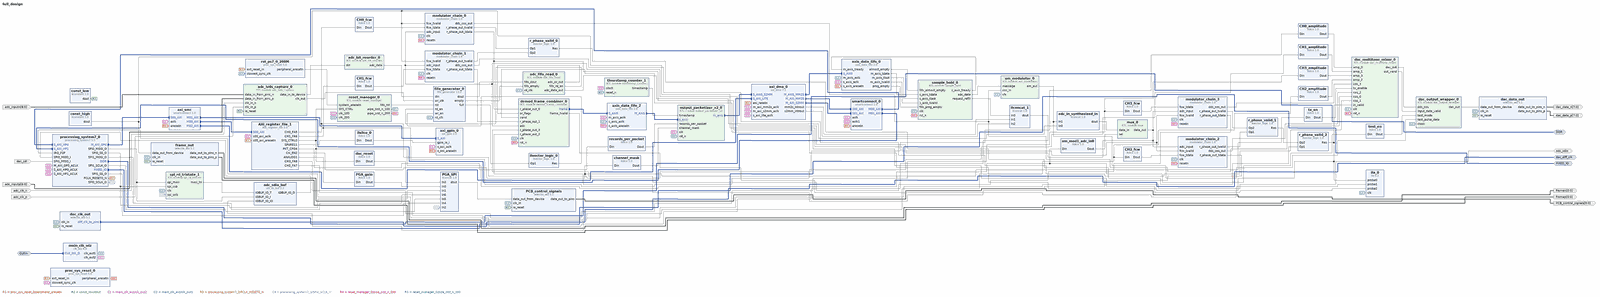
[diagram p0: block diagram of the top level, whole]
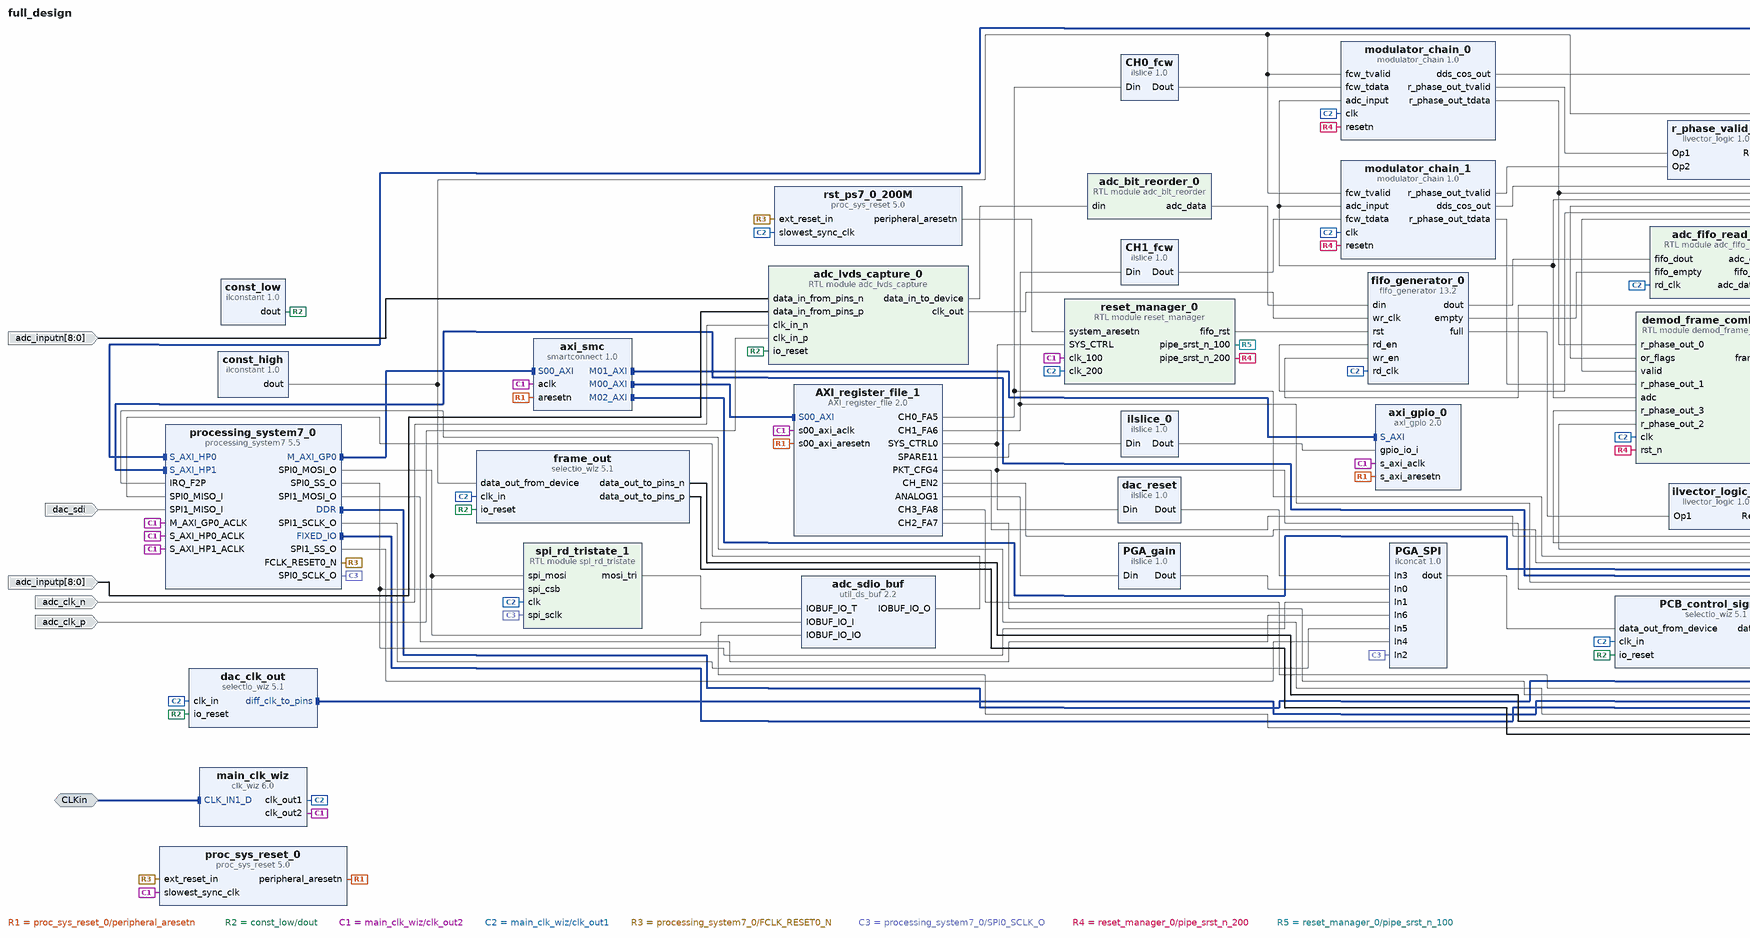
[diagram p1: block diagram of the top level, left part]
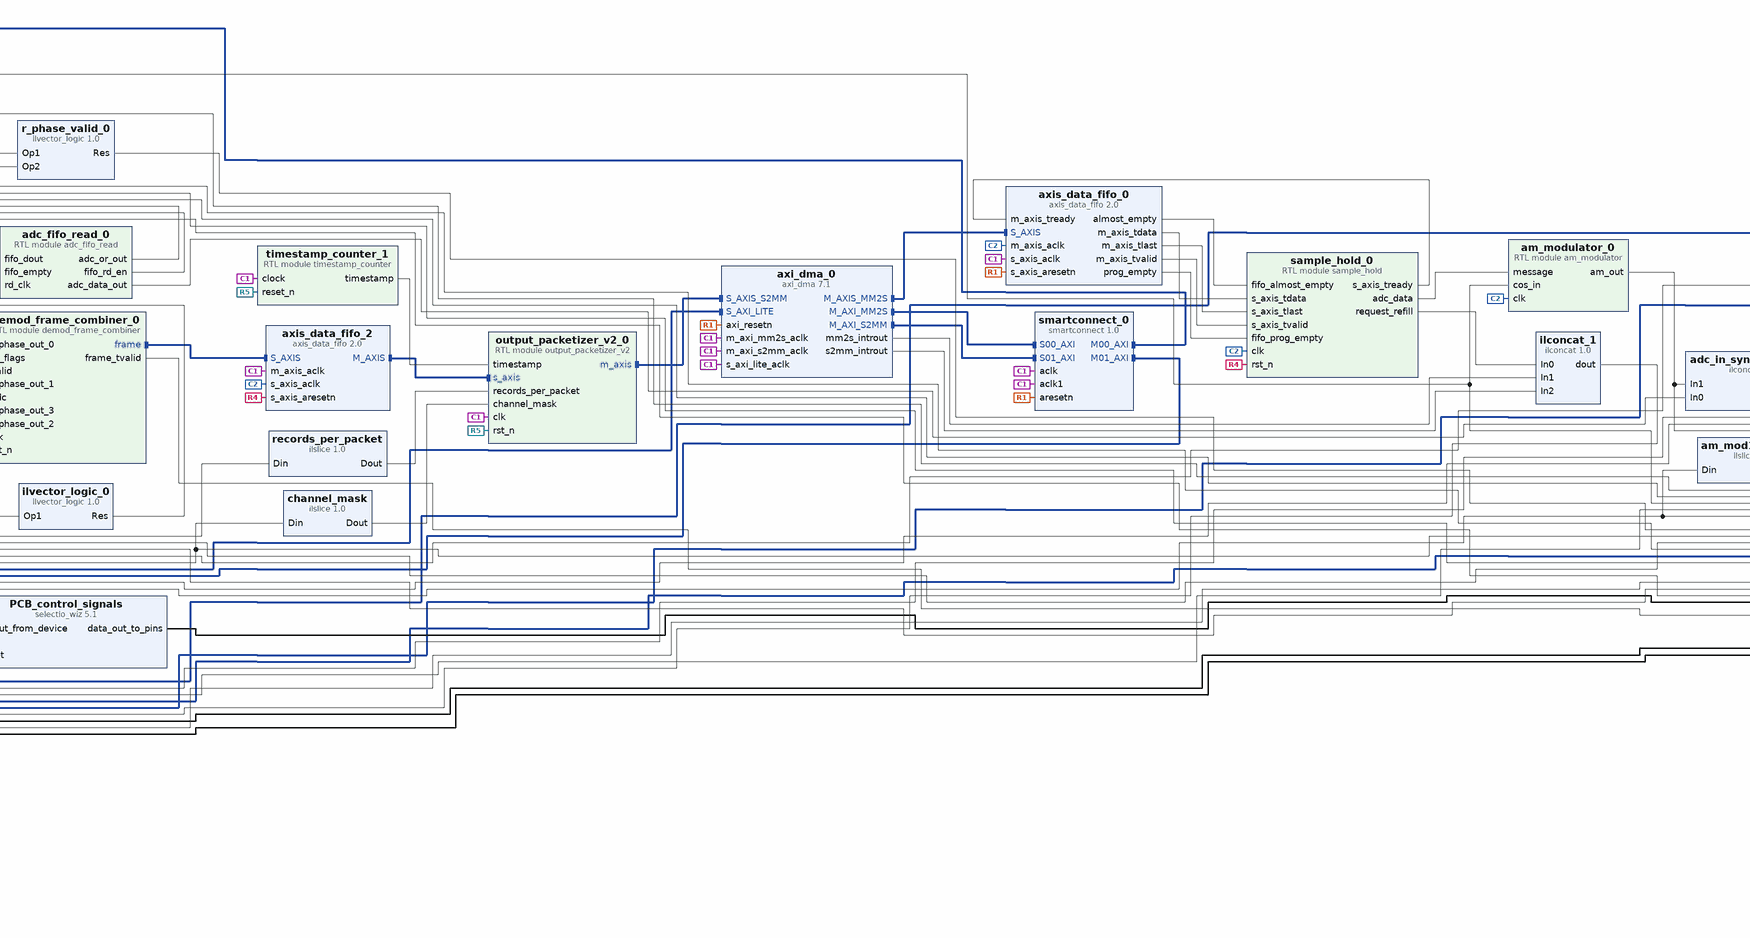
[diagram p2: block diagram of the top level, centre part]
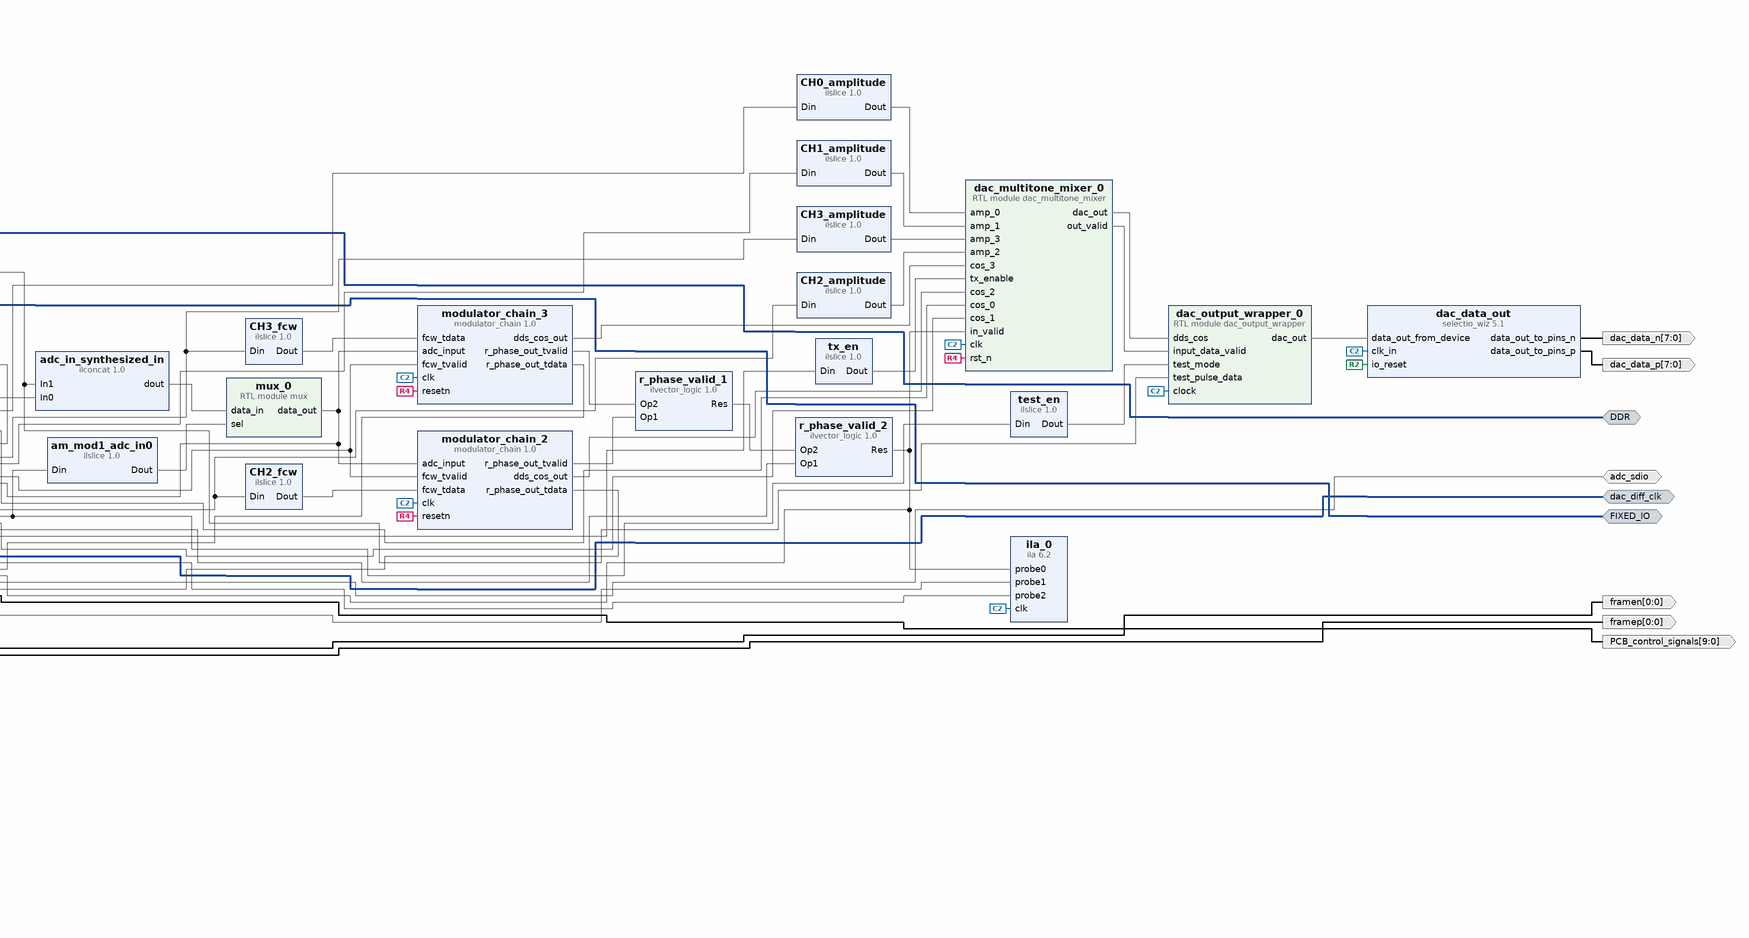
[diagram p3: block diagram of the top level, right part]
# Vivado block design full_design, xc7z020clg484-2, Vivado 2025.2
create_bd_design full_design

create_bd_intf_port -mode Master -vlnv xilinx.com:interface:ddrx_rtl:1.0 DDR
create_bd_intf_port -mode Master -vlnv xilinx.com:display_processing_system7:fixedio_rtl:1.0 FIXED_IO
create_bd_intf_port -mode Master -vlnv xilinx.com:interface:diff_clock_rtl:1.0 dac_diff_clk
create_bd_intf_port -mode Slave -vlnv xilinx.com:interface:diff_clock_rtl:1.0 CLKin
set_property -dict {CONFIG.FREQ_HZ 200000000} [get_bd_intf_ports CLKin]
create_bd_port -dir O -from 7 -to 0 dac_data_p
create_bd_port -dir O -from 7 -to 0 dac_data_n
create_bd_port -dir IO -type data adc_sdio
create_bd_port -dir O -from 9 -to 0 PCB_control_signals
create_bd_port -dir I -type data dac_sdi
create_bd_port -dir I -from 8 -to 0 -type data adc_inputp
create_bd_port -dir I -from 8 -to 0 -type data adc_inputn
create_bd_port -dir O -from 0 -to 0 framen
create_bd_port -dir O -from 0 -to 0 framep
create_bd_port -dir I adc_clk_p
create_bd_port -dir I adc_clk_n

create_bd_cell -type ip -vlnv xilinx.com:ip:processing_system7:5.5 processing_system7_0
set_property -dict [list \
  CONFIG.PCW_ENET0_ENET0_IO {MIO 16 .. 27} \
  CONFIG.PCW_ENET0_GRP_MDIO_ENABLE 1 \
  CONFIG.PCW_ENET0_GRP_MDIO_IO {MIO 52 .. 53} \
  CONFIG.PCW_ENET0_PERIPHERAL_ENABLE 1 \
  CONFIG.PCW_ENET_RESET_ENABLE 0 \
  CONFIG.PCW_EN_CLK0_PORT 0 \
  CONFIG.PCW_FPGA0_PERIPHERAL_FREQMHZ 200 \
  CONFIG.PCW_GPIO_MIO_GPIO_ENABLE 1 \
  CONFIG.PCW_GPIO_MIO_GPIO_IO MIO \
  CONFIG.PCW_I2C0_GRP_INT_ENABLE 0 \
  CONFIG.PCW_I2C0_I2C0_IO {MIO 10 .. 11} \
  CONFIG.PCW_I2C0_PERIPHERAL_ENABLE 1 \
  CONFIG.PCW_I2C1_I2C1_IO EMIO \
  CONFIG.PCW_I2C1_PERIPHERAL_ENABLE 1 \
  CONFIG.PCW_I2C_PERIPHERAL_FREQMHZ 111.111115 \
  CONFIG.PCW_I2C_RESET_ENABLE 0 \
  CONFIG.PCW_IRQ_F2P_INTR 1 \
  CONFIG.PCW_PRESET_BANK1_VOLTAGE {LVCMOS 1.8V} \
  CONFIG.PCW_QSPI_GRP_FBCLK_ENABLE 1 \
  CONFIG.PCW_QSPI_GRP_FBCLK_IO {MIO 8} \
  CONFIG.PCW_QSPI_GRP_SINGLE_SS_ENABLE 1 \
  CONFIG.PCW_QSPI_GRP_SINGLE_SS_IO {MIO 1 .. 6} \
  CONFIG.PCW_QSPI_PERIPHERAL_ENABLE 1 \
  CONFIG.PCW_QSPI_QSPI_IO {MIO 1 .. 6} \
  CONFIG.PCW_SD0_GRP_CD_ENABLE 0 \
  CONFIG.PCW_SD0_GRP_WP_ENABLE 0 \
  CONFIG.PCW_SD0_PERIPHERAL_ENABLE 1 \
  CONFIG.PCW_SD0_SD0_IO {MIO 40 .. 45} \
  CONFIG.PCW_SD1_PERIPHERAL_ENABLE 1 \
  CONFIG.PCW_SD1_SD1_IO {MIO 46 .. 51} \
  CONFIG.PCW_SDIO_PERIPHERAL_FREQMHZ 100 \
  CONFIG.PCW_SINGLE_QSPI_DATA_MODE x4 \
  CONFIG.PCW_SPI0_PERIPHERAL_ENABLE 1 \
  CONFIG.PCW_SPI0_SPI0_IO EMIO \
  CONFIG.PCW_SPI1_PERIPHERAL_ENABLE 1 \
  CONFIG.PCW_SPI1_SPI1_IO EMIO \
  CONFIG.PCW_TTC0_PERIPHERAL_ENABLE 1 \
  CONFIG.PCW_TTC0_TTC0_IO EMIO \
  CONFIG.PCW_TTC1_PERIPHERAL_ENABLE 1 \
  CONFIG.PCW_TTC1_TTC1_IO EMIO \
  CONFIG.PCW_UART0_PERIPHERAL_ENABLE 1 \
  CONFIG.PCW_UART0_UART0_IO {MIO 14 .. 15} \
  CONFIG.PCW_UART1_PERIPHERAL_ENABLE 1 \
  CONFIG.PCW_UART1_UART1_IO {MIO 12 .. 13} \
  CONFIG.PCW_UART_PERIPHERAL_FREQMHZ 100 \
  CONFIG.PCW_UIPARAM_DDR_PARTNO {MT41J256M16 RE-125} \
  CONFIG.PCW_USB0_PERIPHERAL_ENABLE 1 \
  CONFIG.PCW_USB0_USB0_IO {MIO 28 .. 39} \
  CONFIG.PCW_USB_RESET_ENABLE 0 \
  CONFIG.PCW_USE_FABRIC_INTERRUPT 1 \
  CONFIG.PCW_USE_S_AXI_HP0 1 \
  CONFIG.PCW_USE_S_AXI_HP1 1 \
  CONFIG.PCW_WDT_PERIPHERAL_ENABLE 1 \
  CONFIG.PCW_WDT_WDT_IO EMIO \
] [get_bd_cells processing_system7_0]
# 230 more settings of processing_system7_0 are not shown: defaults, MIO pin electricals, DDR timing, and values the tool derives
create_bd_cell -type ip -vlnv xilinx.com:ip:selectio_wiz:5.1 dac_data_out
set_property -dict [list \
  CONFIG.BUS_DIR OUTPUTS \
  CONFIG.BUS_IO_STD LVDS_25 \
  CONFIG.BUS_SIG_TYPE DIFF \
  CONFIG.CLK_FWD false \
  CONFIG.CLK_FWD_IO_STD DIFF_HSTL_I \
  CONFIG.CLK_FWD_SIG_TYPE DIFF \
  CONFIG.SELIO_ACTIVE_EDGE DDR \
  CONFIG.SELIO_BUS_IN_DELAY NONE \
  CONFIG.SELIO_CLK_BUF MMCM \
  CONFIG.SELIO_CLK_IO_STD LVDS_25 \
  CONFIG.SELIO_CLK_SIG_TYPE DIFF \
  CONFIG.SELIO_INTERFACE_TYPE NETWORKING \
  CONFIG.SELIO_ODDR_ALIGNMENT OPPOSITE_EDGE \
  CONFIG.SERIALIZATION_FACTOR 4 \
  CONFIG.SYSTEM_DATA_WIDTH 8 \
] [get_bd_cells dac_data_out]
create_bd_cell -type ip -vlnv xilinx.com:ip:smartconnect:1.0 axi_smc
set_property -dict {CONFIG.NUM_MI 3 CONFIG.NUM_SI 1} [get_bd_cells axi_smc]
create_bd_cell -type ip -vlnv xilinx.com:ip:proc_sys_reset:5.0 rst_ps7_0_200M
create_bd_cell -type ip -vlnv xilinx.com:ip:axi_gpio:2.0 axi_gpio_0
set_property -dict {CONFIG.C_ALL_INPUTS 1 CONFIG.C_GPIO_WIDTH 16 CONFIG.C_IS_DUAL 0} [get_bd_cells axi_gpio_0]
create_bd_cell -type inline_hdl -vlnv xilinx.com:inline_hdl:ilslice:1.0 test_en
set_property -dict {CONFIG.DIN_TO 8} [get_bd_cells test_en]
create_bd_cell -type ip -vlnv xilinx.com:ip:axi_dma:7.1 axi_dma_0
set_property -dict [list \
  CONFIG.c_include_mm2s_dre 0 \
  CONFIG.c_include_s2mm_dre 0 \
  CONFIG.c_include_sg 0 \
  CONFIG.c_m_axis_mm2s_tdata_width 16 \
  CONFIG.c_micro_dma 0 \
  CONFIG.c_sg_length_width 16 \
] [get_bd_cells axi_dma_0]
create_bd_cell -type ip -vlnv xilinx.com:ip:axis_data_fifo:2.0 axis_data_fifo_0
set_property -dict [list \
  CONFIG.FIFO_DEPTH 256 \
  CONFIG.HAS_AEMPTY 1 \
  CONFIG.HAS_PROG_EMPTY 1 \
  CONFIG.HAS_RD_DATA_COUNT 1 \
  CONFIG.HAS_TLAST 1 \
  CONFIG.IS_ACLK_ASYNC 1 \
  CONFIG.PROG_EMPTY_THRESH 251 \
  CONFIG.TDATA_NUM_BYTES 2 \
] [get_bd_cells axis_data_fifo_0]
create_bd_cell -type inline_hdl -vlnv xilinx.com:inline_hdl:ilconcat:1.0 ilconcat_1
set_property -dict {CONFIG.NUM_PORTS 3} [get_bd_cells ilconcat_1]
create_bd_cell -type ip -vlnv xilinx.com:ip:smartconnect:1.0 smartconnect_0
set_property -dict {CONFIG.NUM_CLKS 2 CONFIG.NUM_MI 2} [get_bd_cells smartconnect_0]
create_bd_cell -type module -reference sample_hold sample_hold_0
create_bd_cell -type ip -vlnv xilinx.com:ip:selectio_wiz:5.1 PCB_control_signals
set_property -dict [list \
  CONFIG.BUS_DIR OUTPUTS \
  CONFIG.BUS_IO_STD LVCMOS25 \
  CONFIG.CLK_FWD_IO_STD LVCMOS25 \
  CONFIG.SELIO_BUS_IN_DELAY NONE \
  CONFIG.SELIO_CLK_BUF MMCM \
  CONFIG.SELIO_CLK_IO_STD LVCMOS25 \
  CONFIG.SELIO_INTERFACE_TYPE NETWORKING \
  CONFIG.SERIALIZATION_FACTOR 4 \
  CONFIG.SYSTEM_DATA_WIDTH 10 \
] [get_bd_cells PCB_control_signals]
create_bd_cell -type inline_hdl -vlnv xilinx.com:inline_hdl:ilconcat:1.0 PGA_SPI
set_property -dict {CONFIG.IN0_WIDTH 4 CONFIG.NUM_PORTS 7} [get_bd_cells PGA_SPI]
create_bd_cell -type ip -vlnv xilinx.com:ip:util_ds_buf:2.2 adc_sdio_buf
set_property -dict {CONFIG.C_BUF_TYPE IOBUF} [get_bd_cells adc_sdio_buf]
create_bd_cell -type inline_hdl -vlnv xilinx.com:inline_hdl:ilslice:1.0 PGA_gain
set_property -dict {CONFIG.DIN_FROM 3} [get_bd_cells PGA_gain]
create_bd_cell -type module -reference mux mux_0
set_property -dict {CONFIG.N 2 CONFIG.SEL_BITS 1} [get_bd_cells mux_0]
create_bd_cell -type inline_hdl -vlnv xilinx.com:inline_hdl:ilconcat:1.0 adc_in_synthesized_in
set_property -dict {CONFIG.IN0_WIDTH 16 CONFIG.IN1_WIDTH 16} [get_bd_cells adc_in_synthesized_in]
create_bd_cell -type inline_hdl -vlnv xilinx.com:inline_hdl:ilslice:1.0 am_mod1_adc_in0
set_property -dict {CONFIG.DIN_TO 6} [get_bd_cells am_mod1_adc_in0]
create_bd_cell -type ip -vlnv xilinx.com:ip:clk_wiz:6.0 main_clk_wiz
set_property -dict [list \
  CONFIG.CLKIN1_JITTER_PS 5.0 \
  CONFIG.CLKIN1_UI_JITTER 0.001 \
  CONFIG.CLKIN2_JITTER_PS 1000000.0 \
  CONFIG.CLKIN2_UI_JITTER 0.010 \
  CONFIG.CLKOUT1_JITTER 86.436 \
  CONFIG.CLKOUT1_PHASE_ERROR 76.281 \
  CONFIG.CLKOUT1_REQUESTED_OUT_FREQ 200.000 \
  CONFIG.CLKOUT2_JITTER 98.807 \
  CONFIG.CLKOUT2_PHASE_ERROR 76.281 \
  CONFIG.CLKOUT2_REQUESTED_OUT_FREQ 100.000 \
  CONFIG.CLKOUT2_REQUESTED_PHASE 0 \
  CONFIG.CLKOUT2_USED true \
  CONFIG.JITTER_OPTIONS UI \
  CONFIG.JITTER_SEL Min_O_Jitter \
  CONFIG.MMCM_BANDWIDTH HIGH \
  CONFIG.MMCM_CLKFBOUT_MULT_F 7.000 \
  CONFIG.MMCM_CLKIN1_PERIOD 5.000 \
  CONFIG.MMCM_CLKIN2_PERIOD 10.000 \
  CONFIG.MMCM_CLKOUT0_DIVIDE_F 7.000 \
  CONFIG.MMCM_CLKOUT1_DIVIDE 14 \
  CONFIG.MMCM_CLKOUT1_PHASE 0.000 \
  CONFIG.MMCM_REF_JITTER1 0.001 \
  CONFIG.MMCM_REF_JITTER2 0.010 \
  CONFIG.NUM_OUT_CLKS 2 \
  CONFIG.PRIM_IN_FREQ 200.000 \
  CONFIG.PRIM_SOURCE Differential_clock_capable_pin \
  CONFIG.SECONDARY_SOURCE Single_ended_clock_capable_pin \
  CONFIG.USE_INCLK_SWITCHOVER false \
  CONFIG.USE_LOCKED false \
  CONFIG.USE_RESET false \
] [get_bd_cells main_clk_wiz]
create_bd_cell -type inline_hdl -vlnv xilinx.com:inline_hdl:ilconstant:1.0 const_high
set_property -dict {CONFIG.CONST_VAL 1 CONFIG.CONST_WIDTH 1} [get_bd_cells const_high]
create_bd_cell -type ip -vlnv xilinx.com:ip:fifo_generator:13.2 fifo_generator_0
set_property -dict [list \
  CONFIG.Fifo_Implementation Independent_Clocks_Block_RAM \
  CONFIG.Full_Flags_Reset_Value 0 \
  CONFIG.Input_Depth 32 \
  CONFIG.Performance_Options First_Word_Fall_Through \
] [get_bd_cells fifo_generator_0]
create_bd_cell -type inline_hdl -vlnv xilinx.com:inline_hdl:ilvector_logic:1.0 ilvector_logic_0
set_property -dict {CONFIG.C_OPERATION not CONFIG.C_SIZE 1} [get_bd_cells ilvector_logic_0]
create_bd_cell -type ip -vlnv xilinx.com:ip:selectio_wiz:5.1 frame_out
set_property -dict [list \
  CONFIG.BUS_DIR OUTPUTS \
  CONFIG.BUS_IO_STD LVDS_25 \
  CONFIG.BUS_SIG_TYPE DIFF \
  CONFIG.CLK_FWD_IO_STD LVDS_25 \
  CONFIG.CLK_FWD_SIG_TYPE DIFF \
  CONFIG.SELIO_BUS_IN_DELAY NONE \
  CONFIG.SELIO_CLK_BUF MMCM \
  CONFIG.SELIO_CLK_IO_STD LVDS_25 \
  CONFIG.SELIO_CLK_SIG_TYPE DIFF \
  CONFIG.SELIO_INTERFACE_TYPE NETWORKING \
  CONFIG.SERIALIZATION_FACTOR 4 \
  CONFIG.SYSTEM_DATA_WIDTH 1 \
] [get_bd_cells frame_out]
create_bd_cell -type ip -vlnv xilinx.com:ip:selectio_wiz:5.1 dac_clk_out
set_property -dict [list \
  CONFIG.BUS_DIR OUTPUTS \
  CONFIG.BUS_IO_STD LVDS_25 \
  CONFIG.BUS_SIG_TYPE DIFF \
  CONFIG.CLK_FWD true \
  CONFIG.CLK_FWD_IO_STD LVDS_25 \
  CONFIG.CLK_FWD_SIG_TYPE DIFF \
  CONFIG.CONFIG_CLK_FWD true \
  CONFIG.SELIO_BUS_IN_DELAY NONE \
  CONFIG.SELIO_CLK_BUF MMCM \
  CONFIG.SELIO_CLK_IO_STD LVDS_25 \
  CONFIG.SELIO_CLK_SIG_TYPE DIFF \
  CONFIG.SELIO_INTERFACE_TYPE NETWORKING \
  CONFIG.SERIALIZATION_FACTOR 4 \
  CONFIG.SYSTEM_DATA_WIDTH 1 \
] [get_bd_cells dac_clk_out]
create_bd_cell -type module -reference adc_lvds_capture adc_lvds_capture_0
create_bd_cell -type module -reference adc_fifo_read adc_fifo_read_0
create_bd_cell -type module -reference adc_bit_reorder adc_bit_reorder_0
create_bd_cell -type module -reference spi_rd_tristate spi_rd_tristate_1
create_bd_cell -type inline_hdl -vlnv xilinx.com:inline_hdl:ilconstant:1.0 const_low
set_property -dict {CONFIG.CONST_VAL 0 CONFIG.CONST_WIDTH 1} [get_bd_cells const_low]
create_bd_cell -type module -reference timestamp_counter timestamp_counter_1
create_bd_cell -type ip -vlnv xilinx.com:ip:proc_sys_reset:5.0 proc_sys_reset_0
set_property -dict {CONFIG.C_NUM_INTERCONNECT_ARESETN 1 CONFIG.C_NUM_PERP_ARESETN 1} [get_bd_cells proc_sys_reset_0]
create_bd_cell -type ip -vlnv alexclunan.com:user:AXI_register_file:2.0 AXI_register_file_1
create_bd_cell -type module -reference reset_manager reset_manager_0
create_bd_cell -type inline_hdl -vlnv xilinx.com:inline_hdl:ilslice:1.0 CH0_fcw
set_property -dict {CONFIG.DIN_FROM 15} [get_bd_cells CH0_fcw]
create_bd_cell -type inline_hdl -vlnv xilinx.com:inline_hdl:ilslice:1.0 CH0_amplitude
set_property -dict {CONFIG.DIN_FROM 31 CONFIG.DIN_TO 16} [get_bd_cells CH0_amplitude]
create_bd_cell -type module -reference dac_output_wrapper dac_output_wrapper_0
create_bd_cell -type inline_hdl -vlnv xilinx.com:inline_hdl:ilslice:1.0 CH1_fcw
set_property -dict {CONFIG.DIN_FROM 15} [get_bd_cells CH1_fcw]
create_bd_cell -type inline_hdl -vlnv xilinx.com:inline_hdl:ilslice:1.0 CH1_amplitude
set_property -dict {CONFIG.DIN_FROM 31 CONFIG.DIN_TO 16} [get_bd_cells CH1_amplitude]
create_bd_cell -type module -reference output_packetizer_v2 output_packetizer_v2_0
create_bd_cell -type ip -vlnv xilinx.com:ip:axis_data_fifo:2.0 axis_data_fifo_2
set_property -dict {CONFIG.FIFO_DEPTH 128 CONFIG.IS_ACLK_ASYNC 1 CONFIG.TDATA_NUM_BYTES 36} [get_bd_cells axis_data_fifo_2]
create_bd_cell -type inline_hdl -vlnv xilinx.com:inline_hdl:ilslice:1.0 CH2_amplitude
set_property -dict {CONFIG.DIN_FROM 31 CONFIG.DIN_TO 16} [get_bd_cells CH2_amplitude]
create_bd_cell -type inline_hdl -vlnv xilinx.com:inline_hdl:ilslice:1.0 CH2_fcw
set_property -dict {CONFIG.DIN_FROM 15} [get_bd_cells CH2_fcw]
create_bd_cell -type inline_hdl -vlnv xilinx.com:inline_hdl:ilslice:1.0 CH3_amplitude
set_property -dict {CONFIG.DIN_FROM 31 CONFIG.DIN_TO 16} [get_bd_cells CH3_amplitude]
create_bd_cell -type inline_hdl -vlnv xilinx.com:inline_hdl:ilslice:1.0 CH3_fcw
set_property -dict {CONFIG.DIN_FROM 15} [get_bd_cells CH3_fcw]
create_bd_cell -type inline_hdl -vlnv xilinx.com:inline_hdl:ilslice:1.0 records_per_packet
set_property -dict {CONFIG.DIN_FROM 7} [get_bd_cells records_per_packet]
create_bd_cell -type inline_hdl -vlnv xilinx.com:inline_hdl:ilslice:1.0 channel_mask
set_property -dict {CONFIG.DIN_FROM 8 CONFIG.DIN_TO 4} [get_bd_cells channel_mask]
create_bd_cell -type module -reference dac_multitone_mixer dac_multitone_mixer_0
create_bd_cell -type inline_hdl -vlnv xilinx.com:inline_hdl:ilslice:1.0 tx_en
set_property -dict {CONFIG.DIN_FROM 3} [get_bd_cells tx_en]
create_bd_cell -type inline_hdl -vlnv xilinx.com:inline_hdl:ilslice:1.0 ilslice_0
set_property -dict {CONFIG.DIN_FROM 15} [get_bd_cells ilslice_0]
create_bd_cell -type ip -vlnv alexclunan.com:user:modulator_chain:1.0 modulator_chain_0
create_bd_cell -type ip -vlnv alexclunan.com:user:modulator_chain:1.0 modulator_chain_1
create_bd_cell -type ip -vlnv alexclunan.com:user:modulator_chain:1.0 modulator_chain_3
create_bd_cell -type ip -vlnv alexclunan.com:user:modulator_chain:1.0 modulator_chain_2
create_bd_cell -type inline_hdl -vlnv xilinx.com:inline_hdl:ilslice:1.0 dac_reset
set_property -dict {CONFIG.DIN_FROM 4 CONFIG.DIN_TO 4} [get_bd_cells dac_reset]
create_bd_cell -type module -reference am_modulator am_modulator_0
create_bd_cell -type inline_hdl -vlnv xilinx.com:inline_hdl:ilvector_logic:1.0 r_phase_valid_1
set_property -dict {CONFIG.C_OPERATION or CONFIG.C_SIZE 1} [get_bd_cells r_phase_valid_1]
create_bd_cell -type inline_hdl -vlnv xilinx.com:inline_hdl:ilvector_logic:1.0 r_phase_valid_0
set_property -dict {CONFIG.C_OPERATION or CONFIG.C_SIZE 1} [get_bd_cells r_phase_valid_0]
create_bd_cell -type inline_hdl -vlnv xilinx.com:inline_hdl:ilvector_logic:1.0 r_phase_valid_2
set_property -dict {CONFIG.C_OPERATION or CONFIG.C_SIZE 1} [get_bd_cells r_phase_valid_2]
create_bd_cell -type module -reference demod_frame_combiner demod_frame_combiner_0
create_bd_cell -type ip -vlnv xilinx.com:ip:ila:6.2 ila_0
set_property -dict [list \
  CONFIG.C_DATA_DEPTH 8192 \
  CONFIG.C_MONITOR_TYPE Native \
  CONFIG.C_NUM_OF_PROBES 3 \
  CONFIG.C_PROBE2_WIDTH 16 \
] [get_bd_cells ila_0]

# ---- connections ----

connect_bd_intf_net [get_bd_intf_ports CLKin] [get_bd_intf_pins main_clk_wiz/CLK_IN1_D]
connect_bd_intf_net [get_bd_intf_pins axis_data_fifo_0/S_AXIS] [get_bd_intf_pins axi_dma_0/M_AXIS_MM2S]
connect_bd_intf_net [get_bd_intf_pins smartconnect_0/S00_AXI] [get_bd_intf_pins axi_dma_0/M_AXI_MM2S]
connect_bd_intf_net [get_bd_intf_pins axi_dma_0/M_AXI_S2MM] [get_bd_intf_pins smartconnect_0/S01_AXI]
connect_bd_intf_net [get_bd_intf_pins axi_smc/M00_AXI] [get_bd_intf_pins AXI_register_file_1/S00_AXI]
connect_bd_intf_net [get_bd_intf_pins axi_smc/M01_AXI] [get_bd_intf_pins axi_gpio_0/S_AXI]
connect_bd_intf_net [get_bd_intf_pins axi_smc/M02_AXI] [get_bd_intf_pins axi_dma_0/S_AXI_LITE]
connect_bd_intf_net [get_bd_intf_pins axis_data_fifo_2/M_AXIS] [get_bd_intf_pins output_packetizer_v2_0/s_axis]
connect_bd_intf_net [get_bd_intf_pins demod_frame_combiner_0/frame] [get_bd_intf_pins axis_data_fifo_2/S_AXIS]
connect_bd_intf_net [get_bd_intf_pins output_packetizer_v2_0/m_axis] [get_bd_intf_pins axi_dma_0/S_AXIS_S2MM]
connect_bd_intf_net [get_bd_intf_ports DDR] [get_bd_intf_pins processing_system7_0/DDR]
connect_bd_intf_net [get_bd_intf_ports FIXED_IO] [get_bd_intf_pins processing_system7_0/FIXED_IO]
connect_bd_intf_net [get_bd_intf_pins processing_system7_0/M_AXI_GP0] [get_bd_intf_pins axi_smc/S00_AXI]
connect_bd_intf_net [get_bd_intf_ports dac_diff_clk] [get_bd_intf_pins dac_clk_out/diff_clk_to_pins]
connect_bd_intf_net [get_bd_intf_pins smartconnect_0/M00_AXI] [get_bd_intf_pins processing_system7_0/S_AXI_HP0]
connect_bd_intf_net [get_bd_intf_pins smartconnect_0/M01_AXI] [get_bd_intf_pins processing_system7_0/S_AXI_HP1]
connect_bd_net -net AXI_register_file_0_fcw [get_bd_pins CH0_fcw/Dout] [get_bd_pins modulator_chain_0/fcw_tdata]
connect_bd_net [get_bd_pins AXI_register_file_1/ANALOG1] [get_bd_pins PGA_gain/Din]
connect_bd_net [get_bd_pins AXI_register_file_1/CH0_FA5] [get_bd_pins CH0_fcw/Din] [get_bd_pins CH0_amplitude/Din]
connect_bd_net [get_bd_pins AXI_register_file_1/CH_EN2] [get_bd_pins channel_mask/Din] [get_bd_pins tx_en/Din]
connect_bd_net [get_bd_pins AXI_register_file_1/PKT_CFG4] [get_bd_pins records_per_packet/Din]
connect_bd_net [get_bd_pins AXI_register_file_1/SPARE11] [get_bd_pins ilslice_0/Din]
connect_bd_net [get_bd_pins AXI_register_file_1/SYS_CTRL0] \
  [get_bd_pins reset_manager_0/SYS_CTRL] [get_bd_pins am_mod1_adc_in0/Din] [get_bd_pins test_en/Din] \
  [get_bd_pins dac_reset/Din]
connect_bd_net [get_bd_pins CH0_amplitude/Dout] [get_bd_pins dac_multitone_mixer_0/amp_0]
connect_bd_net [get_bd_pins CH1_amplitude/Dout] [get_bd_pins dac_multitone_mixer_0/amp_1]
connect_bd_net [get_bd_pins CH1_fcw/Dout] [get_bd_pins modulator_chain_1/fcw_tdata]
connect_bd_net [get_bd_pins CH2_amplitude/Dout] [get_bd_pins dac_multitone_mixer_0/amp_2]
connect_bd_net [get_bd_pins CH2_fcw/Dout] [get_bd_pins modulator_chain_2/fcw_tdata]
connect_bd_net [get_bd_pins CH3_amplitude/Dout] [get_bd_pins dac_multitone_mixer_0/amp_3]
connect_bd_net [get_bd_pins CH3_fcw/Dout] [get_bd_pins modulator_chain_3/fcw_tdata]
connect_bd_net [get_bd_ports adc_sdio] [get_bd_pins adc_sdio_buf/IOBUF_IO_IO]
connect_bd_net [get_bd_pins proc_sys_reset_0/peripheral_aresetn] \
  [get_bd_pins axi_gpio_0/s_axi_aresetn] [get_bd_pins axi_dma_0/axi_resetn] [get_bd_pins smartconnect_0/aresetn] \
  [get_bd_pins axi_smc/aresetn] [get_bd_pins axis_data_fifo_0/s_axis_aresetn] \
  [get_bd_pins AXI_register_file_1/s00_axi_aresetn]
connect_bd_net [get_bd_pins AXI_register_file_1/CH1_FA6] [get_bd_pins CH1_fcw/Din] [get_bd_pins CH1_amplitude/Din]
connect_bd_net [get_bd_pins AXI_register_file_1/CH3_FA8] [get_bd_pins CH3_amplitude/Din] [get_bd_pins CH3_fcw/Din]
connect_bd_net [get_bd_pins AXI_register_file_1/CH2_FA7] [get_bd_pins CH2_amplitude/Din] [get_bd_pins CH2_fcw/Din]
connect_bd_net [get_bd_pins PCB_control_signals/data_out_to_pins] [get_bd_ports PCB_control_signals]
connect_bd_net -net PGA_gain1_Dout [get_bd_pins dac_reset/Dout] [get_bd_pins PGA_SPI/In3]
connect_bd_net [get_bd_pins adc_fifo_read_0/adc_data_out] [get_bd_pins adc_in_synthesized_in/In0]
connect_bd_net [get_bd_pins adc_fifo_read_0/adc_or_out] [get_bd_pins demod_frame_combiner_0/or_flags]
connect_bd_net [get_bd_pins adc_fifo_read_0/fifo_rd_en] [get_bd_pins fifo_generator_0/rd_en]
connect_bd_net [get_bd_ports adc_inputn] [get_bd_pins adc_lvds_capture_0/data_in_from_pins_n]
connect_bd_net [get_bd_ports adc_inputp] [get_bd_pins adc_lvds_capture_0/data_in_from_pins_p]
connect_bd_net [get_bd_pins adc_lvds_capture_0/clk_out] [get_bd_pins fifo_generator_0/wr_clk]
connect_bd_net -net adc_lvds_capture_0_data_in_to_device [get_bd_pins adc_bit_reorder_0/adc_data] [get_bd_pins fifo_generator_0/din]
connect_bd_net [get_bd_pins adc_lvds_capture_0/data_in_to_device] [get_bd_pins adc_bit_reorder_0/din]
connect_bd_net [get_bd_pins am_modulator_0/am_out] [get_bd_pins adc_in_synthesized_in/In1] [get_bd_pins dac_output_wrapper_0/test_pulse_data]
connect_bd_net [get_bd_pins axi_dma_0/mm2s_introut] [get_bd_pins ilconcat_1/In1]
connect_bd_net [get_bd_pins axi_dma_0/s2mm_introut] [get_bd_pins ilconcat_1/In2]
connect_bd_net [get_bd_pins axis_data_fifo_0/almost_empty] [get_bd_pins sample_hold_0/fifo_almost_empty]
connect_bd_net [get_bd_pins axis_data_fifo_0/m_axis_tdata] [get_bd_pins sample_hold_0/s_axis_tdata]
connect_bd_net [get_bd_pins axis_data_fifo_0/m_axis_tlast] [get_bd_pins sample_hold_0/s_axis_tlast]
connect_bd_net [get_bd_pins axis_data_fifo_0/m_axis_tvalid] [get_bd_pins sample_hold_0/s_axis_tvalid]
connect_bd_net [get_bd_pins axis_data_fifo_0/prog_empty] [get_bd_pins sample_hold_0/fifo_prog_empty]
connect_bd_net [get_bd_pins channel_mask/Dout] [get_bd_pins output_packetizer_v2_0/channel_mask]
connect_bd_net -net clk_in_n_0_1 [get_bd_ports adc_clk_n] [get_bd_pins adc_lvds_capture_0/clk_in_n]
connect_bd_net -net clk_in_p_0_1 [get_bd_ports adc_clk_p] [get_bd_pins adc_lvds_capture_0/clk_in_p]
connect_bd_net -net dac_io_data_out_to_pins_n [get_bd_pins dac_data_out/data_out_to_pins_n] [get_bd_ports dac_data_n]
connect_bd_net -net dac_io_data_out_to_pins_p [get_bd_pins dac_data_out/data_out_to_pins_p] [get_bd_ports dac_data_p]
connect_bd_net [get_bd_pins dac_multitone_mixer_0/dac_out] [get_bd_pins dac_output_wrapper_0/dds_cos]
connect_bd_net [get_bd_pins dac_multitone_mixer_0/out_valid] [get_bd_pins dac_output_wrapper_0/input_data_valid]
connect_bd_net [get_bd_pins dac_output_wrapper_0/dac_out] [get_bd_pins dac_data_out/data_out_from_device]
connect_bd_net [get_bd_ports dac_sdi] [get_bd_pins processing_system7_0/SPI1_MISO_I]
connect_bd_net -net dac_sin_cos_m_axis_dout_tdata [get_bd_pins modulator_chain_0/dds_cos_out] \
  [get_bd_pins dac_multitone_mixer_0/cos_0] [get_bd_pins am_modulator_0/cos_in]
connect_bd_net [get_bd_pins demod_frame_combiner_0/frame_tvalid] [get_bd_pins ila_0/probe1]
connect_bd_net [get_bd_pins fifo_generator_0/dout] [get_bd_pins adc_fifo_read_0/fifo_dout]
connect_bd_net [get_bd_pins fifo_generator_0/empty] [get_bd_pins adc_fifo_read_0/fifo_empty]
connect_bd_net [get_bd_pins fifo_generator_0/full] [get_bd_pins ilvector_logic_0/Op1]
connect_bd_net [get_bd_pins ilconcat_1/dout] [get_bd_pins processing_system7_0/IRQ_F2P]
connect_bd_net -net ilconcat_2_dout [get_bd_pins PGA_SPI/dout] [get_bd_pins PCB_control_signals/data_out_from_device]
connect_bd_net -net ilconcat_3_dout [get_bd_pins adc_in_synthesized_in/dout] [get_bd_pins mux_0/data_in]
connect_bd_net -net ilconstant_1_dout [get_bd_pins const_high/dout] \
  [get_bd_pins frame_out/data_out_from_device] [get_bd_pins modulator_chain_0/fcw_tvalid] \
  [get_bd_pins modulator_chain_3/fcw_tvalid] [get_bd_pins modulator_chain_2/fcw_tvalid] \
  [get_bd_pins modulator_chain_1/fcw_tvalid]
connect_bd_net -net ilconstant_4_dout [get_bd_pins const_low/dout] \
  [get_bd_pins frame_out/io_reset] [get_bd_pins PCB_control_signals/io_reset] [get_bd_pins dac_data_out/io_reset] \
  [get_bd_pins dac_clk_out/io_reset] [get_bd_pins adc_lvds_capture_0/io_reset]
connect_bd_net [get_bd_pins ilslice_0/Dout] [get_bd_pins axi_gpio_0/gpio_io_i]
connect_bd_net -net ilslice_0_Dout1 [get_bd_pins PGA_gain/Dout] [get_bd_pins PGA_SPI/In0]
connect_bd_net -net ilslice_0_Dout2 [get_bd_pins am_mod1_adc_in0/Dout] [get_bd_pins mux_0/sel]
connect_bd_net [get_bd_pins ilvector_logic_0/Res] [get_bd_pins fifo_generator_0/wr_en]
connect_bd_net -net ilvector_logic_1_Res [get_bd_pins r_phase_valid_1/Res] [get_bd_pins r_phase_valid_2/Op2]
connect_bd_net -net ilvector_logic_2_Res [get_bd_pins r_phase_valid_0/Res] [get_bd_pins r_phase_valid_2/Op1]
connect_bd_net [get_bd_pins main_clk_wiz/clk_out2] \
  [get_bd_pins processing_system7_0/M_AXI_GP0_ACLK] [get_bd_pins processing_system7_0/S_AXI_HP0_ACLK] \
  [get_bd_pins processing_system7_0/S_AXI_HP1_ACLK] [get_bd_pins smartconnect_0/aclk1] \
  [get_bd_pins axi_dma_0/m_axi_mm2s_aclk] [get_bd_pins axis_data_fifo_0/s_axis_aclk] [get_bd_pins axi_dma_0/m_axi_s2mm_aclk] \
  [get_bd_pins axi_dma_0/s_axi_lite_aclk] [get_bd_pins axi_smc/aclk] [get_bd_pins axi_gpio_0/s_axi_aclk] \
  [get_bd_pins timestamp_counter_1/clock] [get_bd_pins smartconnect_0/aclk] [get_bd_pins proc_sys_reset_0/slowest_sync_clk] \
  [get_bd_pins AXI_register_file_1/s00_axi_aclk] [get_bd_pins reset_manager_0/clk_100] \
  [get_bd_pins output_packetizer_v2_0/clk] [get_bd_pins axis_data_fifo_2/m_axis_aclk]
connect_bd_net [get_bd_pins modulator_chain_0/r_phase_out_tvalid] [get_bd_pins r_phase_valid_0/Op1]
connect_bd_net [get_bd_pins modulator_chain_1/r_phase_out_tvalid] [get_bd_pins r_phase_valid_0/Op2]
connect_bd_net [get_bd_pins modulator_chain_2/r_phase_out_tvalid] [get_bd_pins r_phase_valid_1/Op1]
connect_bd_net [get_bd_pins modulator_chain_3/r_phase_out_tvalid] [get_bd_pins r_phase_valid_1/Op2]
connect_bd_net -net modulator_chain_4_dds_cos_out [get_bd_pins modulator_chain_1/dds_cos_out] [get_bd_pins dac_multitone_mixer_0/cos_1]
connect_bd_net -net modulator_chain_4_r_phase_out_tdata [get_bd_pins modulator_chain_0/r_phase_out_tdata] \
  [get_bd_pins demod_frame_combiner_0/r_phase_out_0] [get_bd_pins ila_0/probe2]
connect_bd_net -net modulator_chain_4_r_phase_out_tdata1 [get_bd_pins modulator_chain_1/r_phase_out_tdata] \
  [get_bd_pins demod_frame_combiner_0/r_phase_out_1]
connect_bd_net -net modulator_chain_4_r_phase_out_tvalid [get_bd_pins r_phase_valid_2/Res] \
  [get_bd_pins dac_multitone_mixer_0/in_valid] [get_bd_pins demod_frame_combiner_0/valid] [get_bd_pins ila_0/probe0]
connect_bd_net -net modulator_chain_5_dds_cos_out [get_bd_pins modulator_chain_3/dds_cos_out] [get_bd_pins dac_multitone_mixer_0/cos_3]
connect_bd_net -net modulator_chain_5_r_phase_out_tdata [get_bd_pins modulator_chain_3/r_phase_out_tdata] \
  [get_bd_pins demod_frame_combiner_0/r_phase_out_3]
connect_bd_net -net modulator_chain_6_dds_cos_out [get_bd_pins modulator_chain_2/dds_cos_out] [get_bd_pins dac_multitone_mixer_0/cos_2]
connect_bd_net -net modulator_chain_6_r_phase_out_tdata [get_bd_pins modulator_chain_2/r_phase_out_tdata] \
  [get_bd_pins demod_frame_combiner_0/r_phase_out_2]
connect_bd_net [get_bd_pins mux_0/data_out] \
  [get_bd_pins modulator_chain_0/adc_input] [get_bd_pins modulator_chain_2/adc_input] \
  [get_bd_pins modulator_chain_3/adc_input] [get_bd_pins modulator_chain_1/adc_input] \
  [get_bd_pins demod_frame_combiner_0/adc]
connect_bd_net -net processing_system7_0_FCLK_CLK0 [get_bd_pins main_clk_wiz/clk_out1] \
  [get_bd_pins rst_ps7_0_200M/slowest_sync_clk] [get_bd_pins sample_hold_0/clk] [get_bd_pins PCB_control_signals/clk_in] \
  [get_bd_pins fifo_generator_0/rd_clk] [get_bd_pins frame_out/clk_in] [get_bd_pins dac_data_out/clk_in] \
  [get_bd_pins dac_clk_out/clk_in] [get_bd_pins adc_fifo_read_0/rd_clk] [get_bd_pins spi_rd_tristate_1/clk] \
  [get_bd_pins axis_data_fifo_0/m_axis_aclk] [get_bd_pins reset_manager_0/clk_200] [get_bd_pins dac_output_wrapper_0/clock] \
  [get_bd_pins axis_data_fifo_2/s_axis_aclk] [get_bd_pins dac_multitone_mixer_0/clk] [get_bd_pins modulator_chain_0/clk] \
  [get_bd_pins modulator_chain_1/clk] [get_bd_pins modulator_chain_2/clk] [get_bd_pins modulator_chain_3/clk] \
  [get_bd_pins am_modulator_0/clk] [get_bd_pins demod_frame_combiner_0/clk] [get_bd_pins ila_0/clk]
connect_bd_net [get_bd_pins processing_system7_0/FCLK_RESET0_N] [get_bd_pins rst_ps7_0_200M/ext_reset_in] [get_bd_pins proc_sys_reset_0/ext_reset_in]
connect_bd_net [get_bd_pins processing_system7_0/SPI0_MOSI_O] [get_bd_pins adc_sdio_buf/IOBUF_IO_I] [get_bd_pins spi_rd_tristate_1/spi_mosi]
connect_bd_net [get_bd_pins processing_system7_0/SPI0_SCLK_O] [get_bd_pins PGA_SPI/In2] [get_bd_pins spi_rd_tristate_1/spi_sclk]
connect_bd_net [get_bd_pins processing_system7_0/SPI0_SS_O] [get_bd_pins PGA_SPI/In1] [get_bd_pins spi_rd_tristate_1/spi_csb]
connect_bd_net [get_bd_pins processing_system7_0/SPI1_MOSI_O] [get_bd_pins PGA_SPI/In6]
connect_bd_net [get_bd_pins processing_system7_0/SPI1_SCLK_O] [get_bd_pins PGA_SPI/In5]
connect_bd_net [get_bd_pins processing_system7_0/SPI1_SS_O] [get_bd_pins PGA_SPI/In4]
connect_bd_net [get_bd_pins records_per_packet/Dout] [get_bd_pins output_packetizer_v2_0/records_per_packet]
connect_bd_net [get_bd_pins reset_manager_0/fifo_rst] [get_bd_pins fifo_generator_0/rst]
connect_bd_net [get_bd_pins reset_manager_0/pipe_srst_n_200] \
  [get_bd_pins sample_hold_0/rst_n] [get_bd_pins axis_data_fifo_2/s_axis_aresetn] [get_bd_pins dac_multitone_mixer_0/rst_n] \
  [get_bd_pins modulator_chain_0/resetn] [get_bd_pins modulator_chain_2/resetn] [get_bd_pins modulator_chain_3/resetn] \
  [get_bd_pins modulator_chain_1/resetn] [get_bd_pins demod_frame_combiner_0/rst_n]
connect_bd_net [get_bd_pins reset_manager_0/pipe_srst_n_100] [get_bd_pins output_packetizer_v2_0/rst_n] [get_bd_pins timestamp_counter_1/reset_n]
connect_bd_net -net rst_ps7_0_100M_peripheral_aresetn [get_bd_pins rst_ps7_0_200M/peripheral_aresetn] [get_bd_pins reset_manager_0/system_aresetn]
connect_bd_net -net sample_hold_1_adc_data [get_bd_pins sample_hold_0/adc_data] [get_bd_pins am_modulator_0/message]
connect_bd_net -net sample_hold_1_request_refill [get_bd_pins sample_hold_0/request_refill] [get_bd_pins ilconcat_1/In0]
connect_bd_net -net sample_hold_1_s_axis_tready [get_bd_pins sample_hold_0/s_axis_tready] [get_bd_pins axis_data_fifo_0/m_axis_tready]
connect_bd_net -net selectio_wiz_0_data_out_to_pins_n [get_bd_pins frame_out/data_out_to_pins_n] [get_bd_ports framen]
connect_bd_net -net selectio_wiz_0_data_out_to_pins_p [get_bd_pins frame_out/data_out_to_pins_p] [get_bd_ports framep]
connect_bd_net [get_bd_pins spi_rd_tristate_1/mosi_tri] [get_bd_pins adc_sdio_buf/IOBUF_IO_T]
connect_bd_net [get_bd_pins test_en/Dout] [get_bd_pins dac_output_wrapper_0/test_mode]
connect_bd_net [get_bd_pins timestamp_counter_1/timestamp] [get_bd_pins output_packetizer_v2_0/timestamp]
connect_bd_net [get_bd_pins tx_en/Dout] [get_bd_pins dac_multitone_mixer_0/tx_enable]
connect_bd_net -net util_ds_buf_0_IOBUF_IO_O [get_bd_pins adc_sdio_buf/IOBUF_IO_O] [get_bd_pins processing_system7_0/SPI0_MISO_I]

# ---- address map ----
assign_bd_address -offset 0x00000000 -range 1G -target_address_space [get_bd_addr_spaces axi_dma_0/Data_MM2S] [get_bd_addr_segs processing_system7_0/S_AXI_HP0/HP0_DDR_LOWOCM]
exclude_bd_addr_seg -offset 0x00000000 -range 1 -target_address_space [get_bd_addr_spaces axi_dma_0/Data_MM2S] [get_bd_addr_segs processing_system7_0/S_AXI_HP1/HP1_DDR_LOWOCM]
assign_bd_address -offset 0x00000000 -range 512M -target_address_space [get_bd_addr_spaces axi_dma_0/Data_S2MM] [get_bd_addr_segs processing_system7_0/S_AXI_HP0/HP0_DDR_LOWOCM]
assign_bd_address -offset 0x20000000 -range 512M -target_address_space [get_bd_addr_spaces axi_dma_0/Data_S2MM] [get_bd_addr_segs processing_system7_0/S_AXI_HP1/HP1_DDR_LOWOCM]
assign_bd_address -offset 0x40400000 -range 64K -target_address_space [get_bd_addr_spaces processing_system7_0/Data] [get_bd_addr_segs axi_dma_0/S_AXI_LITE/Reg]
assign_bd_address -offset 0x41200000 -range 64K -target_address_space [get_bd_addr_spaces processing_system7_0/Data] [get_bd_addr_segs axi_gpio_0/S_AXI/Reg]
assign_bd_address -offset 0x43C00000 -range 64K -target_address_space [get_bd_addr_spaces processing_system7_0/Data] [get_bd_addr_segs AXI_register_file_1/S00_AXI/S00_AXI_reg]

validate_bd_design
save_bd_design
